# EAGLE board p8x-backplane-a (EAGLE 9.7.0)
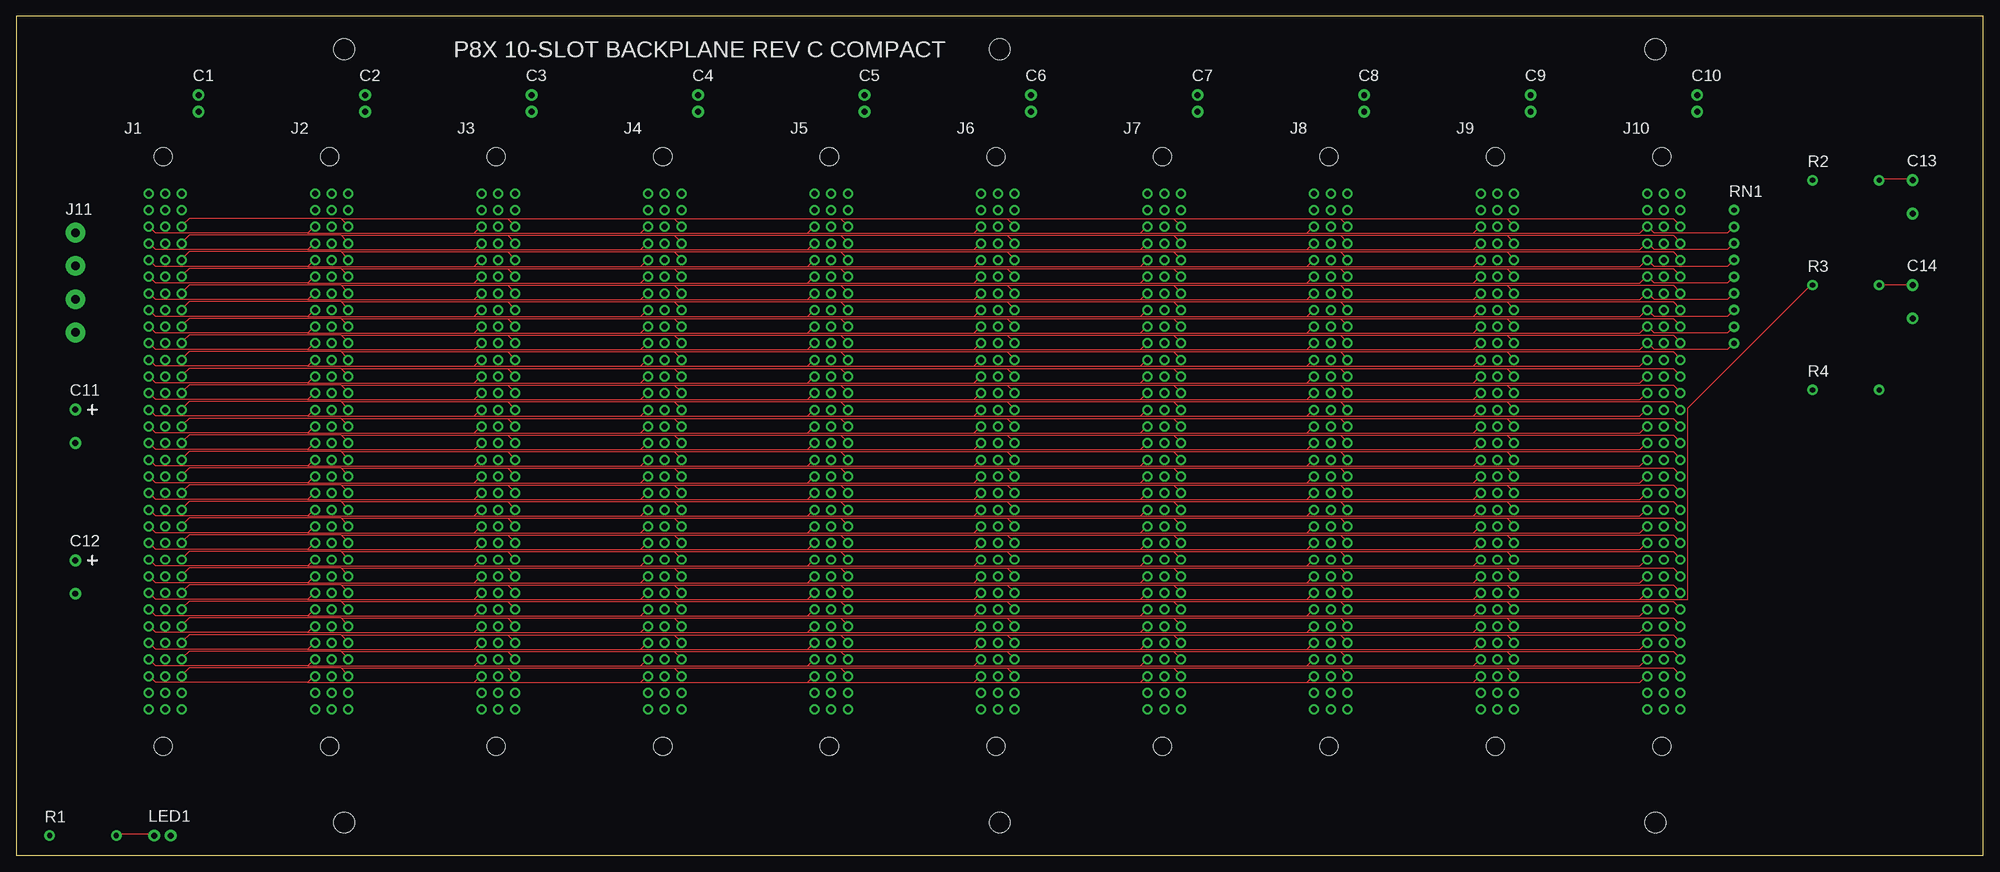
[diagram p5: board, top side]
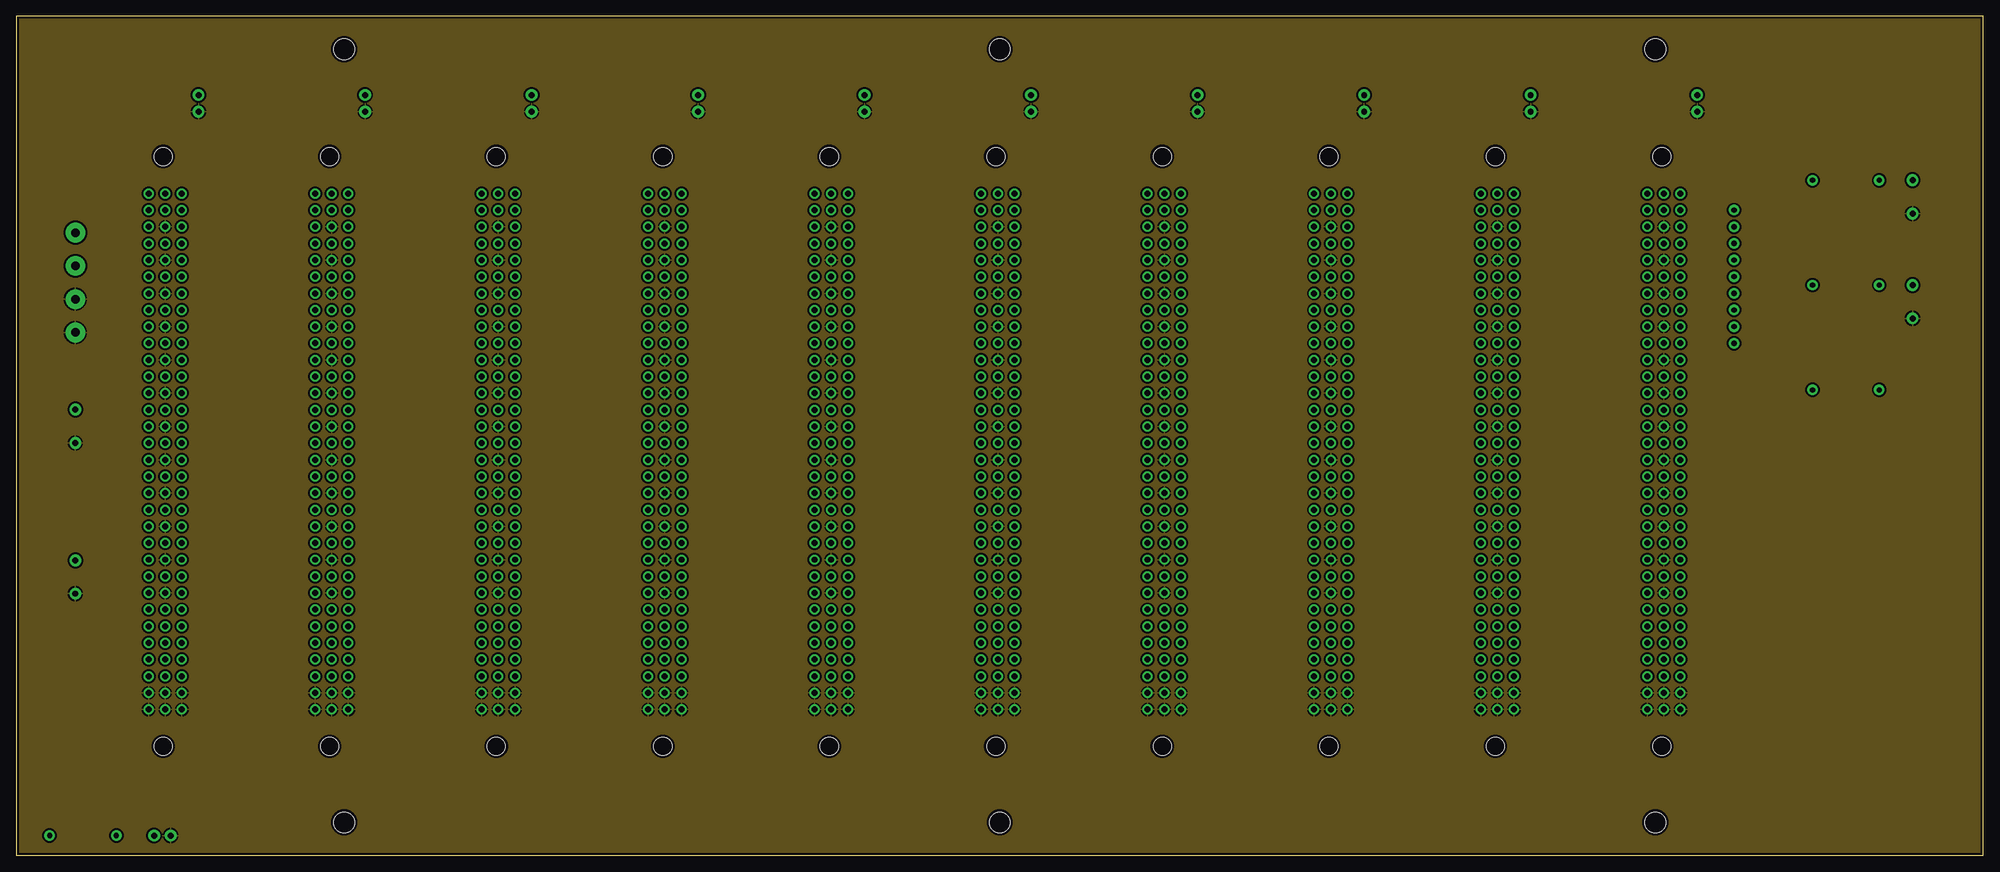
[diagram p6: board, inner layer Route2]
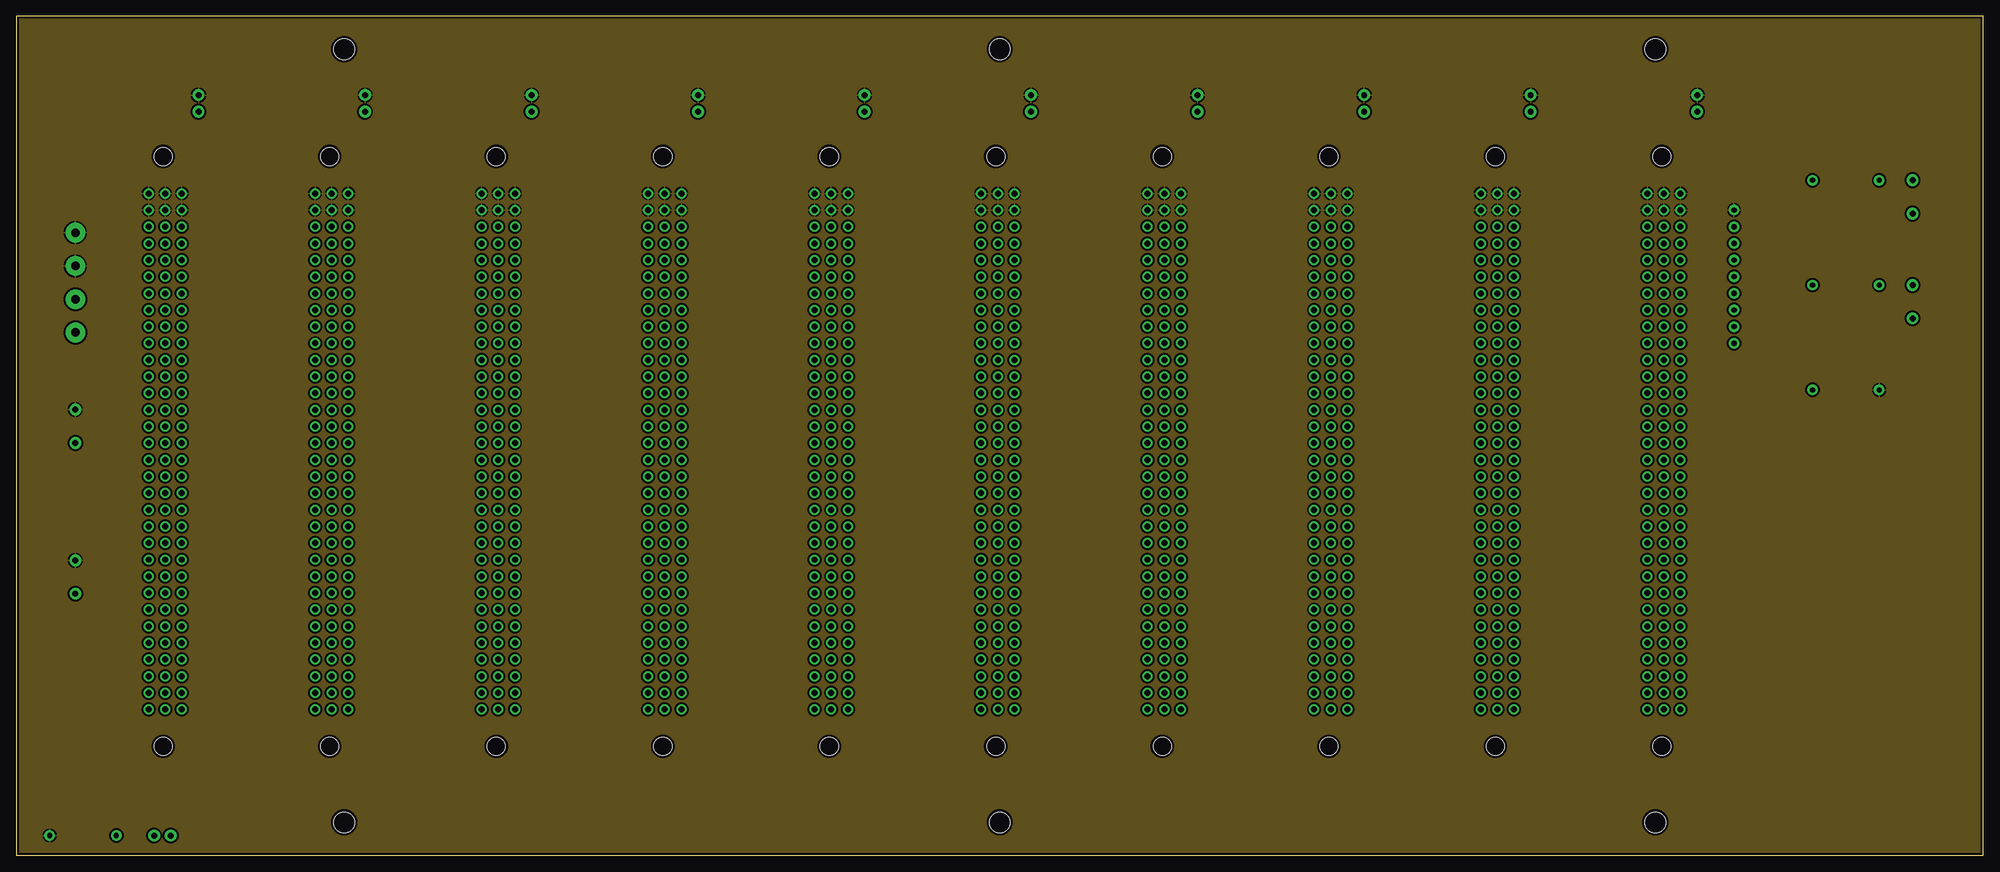
[diagram p7: board, inner layer Route15]
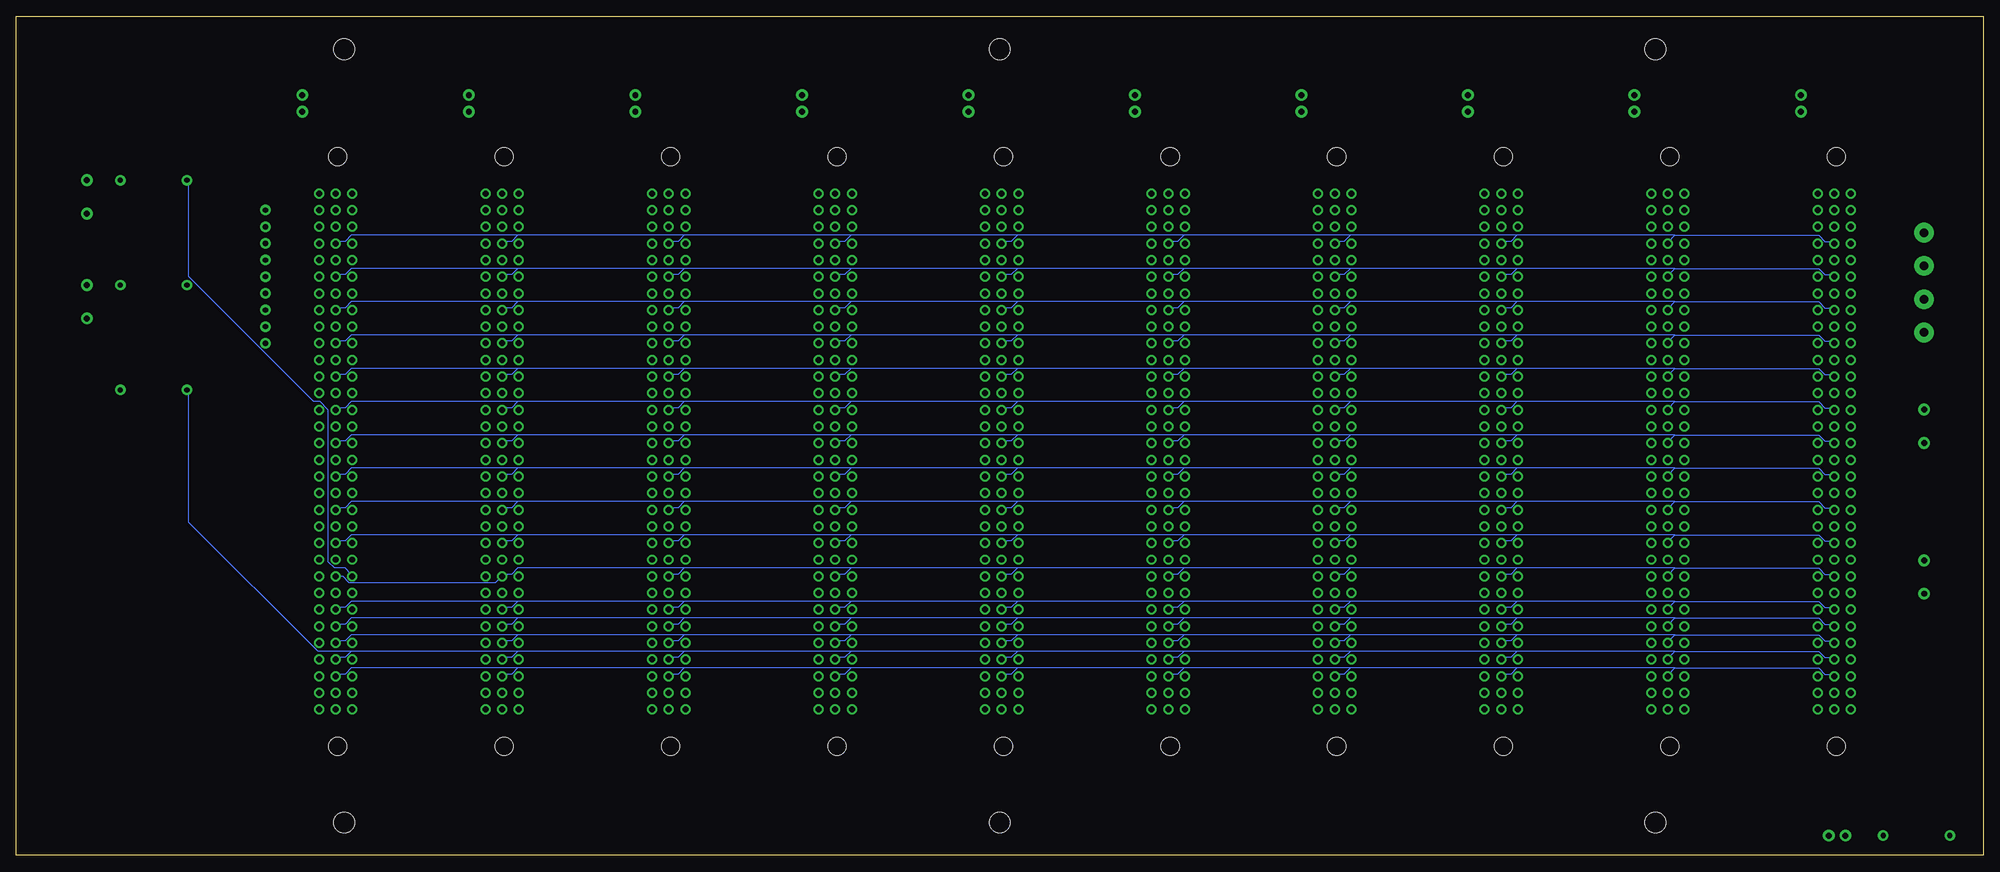
[diagram p8: board, bottom side, seen from below]

Size 300 x 128 mm. Coordinates in mm from the lower left corner, seen from the top.
Outline: 0,0 300,0 300,128 0,128 0,0
Copper layers (1*2*15*16): Top 0.035559375mm / dielectric 0.17018125mm / Route2 0.01778125mm / dielectric 47mil / Route15 0.01778125mm / dielectric 0.17018125mm / Bottom 0.035559375mm
Design rules "oshpark-4layer.dru": minimum track width 5mil, minimum drill 10mil, track to track 5mil, track to pad 5mil, pad to pad 5mil, via to via 5mil, smd to smd 5mil, copper to edge 15mil, drill to drill 6mil, minimum pad ring 4mil, minimum via ring 4mil, stop-mask expansion 1.5mil, vias tented up to drill 0mil, thermal gap 10mil
Holes 3.2 mm at 50,5 150,5 250,5 50,123 150,123 250,123

## Footprints (pad centres in the part's own frame; a part is rotated, then mirrored left to right if it is on the bottom)
C_DISC1 = drill 0.9 pad 1.8: 1 0,0; 2 0,-2.54
CP_RADIAL = drill 0.9 pad 1.8: 1 0,0; 2 0,-5.08
C_DISC = drill 0.9 pad 1.8: 1 0,0; 2 0,-5.08
FABC96S = drill 0.914 pad 1.524: A1 -2.54,39.37; A2 -2.54,36.83; A3 -2.54,34.29; A4 -2.54,31.75; A5 -2.54,29.21; A6 -2.54,26.67; A7 -2.54,24.13; A8 -2.54,21.59; A9 -2.54,19.05; A10 -2.54,16.51; A11 -2.54,13.97; A12 -2.54,11.43; A13 -2.54,8.89; A14 -2.54,6.35; A15 -2.54,3.81; A16 -2.54,1.27; A17 -2.54,-1.27; A18 -2.54,-3.81; A19 -2.54,-6.35; A20 -2.54,-8.89; A21 -2.54,-11.43; A22 -2.54,-13.97; A23 -2.54,-16.51; A24 -2.54,-19.05; A25 -2.54,-21.59; A26 -2.54,-24.13; A27 -2.54,-26.67; A28 -2.54,-29.21; A29 -2.54,-31.75; A30 -2.54,-34.29; A31 -2.54,-36.83; A32 -2.54,-39.37; B1 0,39.37; B2 0,36.83; B3 0,34.29; B4 0,31.75; B5 0,29.21; B6 0,26.67; B7 0,24.13; B8 0,21.59; B9 0,19.05; B10 0,16.51; B11 0,13.97; B12 0,11.43; B13 0,8.89; B14 0,6.35; B15 0,3.81; B16 0,1.27; B17 0,-1.27; B18 0,-3.81; B19 0,-6.35; B20 0,-8.89; B21 0,-11.43; B22 0,-13.97; B23 0,-16.51; B24 0,-19.05; B25 0,-21.59; B26 0,-24.13; B27 0,-26.67; B28 0,-29.21; B29 0,-31.75; B30 0,-34.29; B31 0,-36.83; B32 0,-39.37; C1 2.54,39.37; C2 2.54,36.83; C3 2.54,34.29; C4 2.54,31.75; C5 2.54,29.21; C6 2.54,26.67; C7 2.54,24.13; C8 2.54,21.59; C9 2.54,19.05; C10 2.54,16.51; C11 2.54,13.97; C12 2.54,11.43; C13 2.54,8.89; C14 2.54,6.35; C15 2.54,3.81; C16 2.54,1.27; C17 2.54,-1.27; C18 2.54,-3.81; C19 2.54,-6.35; C20 2.54,-8.89; C21 2.54,-11.43; C22 2.54,-13.97; C23 2.54,-16.51; C24 2.54,-19.05; C25 2.54,-21.59; C26 2.54,-24.13; C27 2.54,-26.67; C28 2.54,-29.21; C29 2.54,-31.75; C30 2.54,-34.29; C31 2.54,-36.83; C32 2.54,-39.37 | hole 2.794: -0.3,45; -0.3,-45
TB4 = drill 1.3 pad 3: 1 0,0; 2 0,-5.08; 3 0,-10.16; 4 0,-15.24
LED5 = drill 0.9 pad 1.8: 1 2.54,0; 2 0,0
R_AXIAL = drill 0.8 pad 1.6: 1 0,0; 2 10.16,0
SIP9 = drill 0.8 pad 1.6: 1 0,0; 2 0,-2.54; 3 0,-5.08; 4 0,-7.62; 5 0,-10.16; 6 0,-12.7; 7 0,-15.24; 8 0,-17.78; 9 0,-20.32

## Placement (x,y rotation side)
C1  100nF  [C_DISC1]  27.78,116 0 top
C2  100nF  [C_DISC1]  53.18,116 0 top
C3  100nF  [C_DISC1]  78.58,116 0 top
C4  100nF  [C_DISC1]  103.98,116 0 top
C5  100nF  [C_DISC1]  129.38,116 0 top
C6  100nF  [C_DISC1]  154.78,116 0 top
C7  100nF  [C_DISC1]  180.18,116 0 top
C8  100nF  [C_DISC1]  205.58,116 0 top
C9  100nF  [C_DISC1]  230.98,116 0 top
C10  100nF  [C_DISC1]  256.38,116 0 top
C11  470uF  [CP_RADIAL]  9,68 0 top
C12  470uF  [CP_RADIAL]  9,45 0 top
C13  150pF  [C_DISC]  289.24,103 0 top
C14  150pF  [C_DISC]  289.24,87 0 top
J1  SLOT1  [FABC96S]  22.7,61.61 0 top
J2  SLOT2  [FABC96S]  48.1,61.61 0 top
J3  SLOT3  [FABC96S]  73.5,61.61 0 top
J4  SLOT4  [FABC96S]  98.9,61.61 0 top
J5  SLOT5  [FABC96S]  124.3,61.61 0 top
J6  SLOT6  [FABC96S]  149.7,61.61 0 top
J7  SLOT7  [FABC96S]  175.1,61.61 0 top
J8  SLOT8  [FABC96S]  200.5,61.61 0 top
J9  SLOT9  [FABC96S]  225.9,61.61 0 top
J10  SLOT10  [FABC96S]  251.3,61.61 0 top
J11  PWR-5V  [TB4]  9,95 0 top
LED1  PWR  [LED5]  21,3 0 top
R1  1K  [R_AXIAL]  5.08,3 0 top
R2  100R  [R_AXIAL]  274,103 0 top
R3  100R  [R_AXIAL]  274,87 0 top
R4  10K  [R_AXIAL]  274,71 0 top
RN1  8X10K  [SIP9]  262,98.44 0 top

## Tracks (layer width: path | path; a pad name or v marks a point on that pad's centre or on a via)
-RES
  Top 0.127: 44.45,74.61 21.27,74.61 20.32,75.56 J1.A11 | 44.45,74.61 45.4,75.56 J2.A11 | 69.85,74.61 70.8,75.56 J3.A11 | 44.45,74.61 69.85,74.61 | 95.25,74.61 96.2,75.56 J4.A11 | 69.85,74.61 95.25,74.61 | 120.65,74.61 121.6,75.56 J5.A11 | 95.25,74.61 120.65,74.61 | 146.05,74.61 147,75.56 J6.A11 | 120.65,74.61 146.05,74.61 | 171.45,74.61 172.4,75.56 J7.A11 | 146.05,74.61 171.45,74.61 | 196.85,74.61 197.8,75.56 J8.A11 | 171.45,74.61 196.85,74.61 | 222.25,74.61 223.2,75.56 J9.A11 | 196.85,74.61 222.25,74.61 | 222.25,74.61 247.65,74.61 248.6,75.56 J10.A11
A0
  Top 0.127: 49.53,97.16 26.35,97.16 25.4,96.2 J1.C3 | 49.53,97.16 50.48,96.2 J2.C3 | 74.93,97.16 75.88,96.2 J3.C3 | 49.53,97.16 74.93,97.16 | 100.33,97.16 101.28,96.2 J4.C3 | 74.93,97.16 100.33,97.16 | 125.73,97.16 126.68,96.2 J5.C3 | 100.33,97.16 125.73,97.16 | 151.13,97.16 152.08,96.2 J6.C3 | 125.73,97.16 151.13,97.16 | 176.53,97.16 177.48,96.2 J7.C3 | 151.13,97.16 176.53,97.16 | 201.93,97.16 202.88,96.2 J8.C3 | 176.53,97.16 201.93,97.16 | 227.33,97.16 228.28,96.2 J9.C3 | 201.93,97.16 227.33,97.16 | 227.33,97.16 252.73,97.16 253.68,96.2 J10.C3
A1
  Top 0.127: 49.53,94.61 26.35,94.61 25.4,93.66 J1.C4 | 49.53,94.61 50.48,93.66 J2.C4 | 74.93,94.61 75.88,93.66 J3.C4 | 49.53,94.61 74.93,94.61 | 100.33,94.61 101.28,93.66 J4.C4 | 74.93,94.61 100.33,94.61 | 125.73,94.61 126.68,93.66 J5.C4 | 100.33,94.61 125.73,94.61 | 151.13,94.61 152.08,93.66 J6.C4 | 125.73,94.61 151.13,94.61 | 176.53,94.61 177.48,93.66 J7.C4 | 151.13,94.61 176.53,94.61 | 201.93,94.61 202.88,93.66 J8.C4 | 176.53,94.61 201.93,94.61 | 227.33,94.61 228.28,93.66 J9.C4 | 201.93,94.61 227.33,94.61 | 227.33,94.61 252.73,94.61 253.68,93.66 J10.C4
A2
  Top 0.127: 49.53,92.08 26.35,92.08 25.4,91.12 J1.C5 | 49.53,92.08 50.48,91.12 J2.C5 | 74.93,92.08 75.88,91.12 J3.C5 | 49.53,92.08 74.93,92.08 | 100.33,92.08 101.28,91.12 J4.C5 | 74.93,92.08 100.33,92.08 | 125.73,92.08 126.68,91.12 J5.C5 | 100.33,92.08 125.73,92.08 | 151.13,92.08 152.08,91.12 J6.C5 | 125.73,92.08 151.13,92.08 | 176.53,92.08 177.48,91.12 J7.C5 | 151.13,92.08 176.53,92.08 | 201.93,92.08 202.88,91.12 J8.C5 | 176.53,92.08 201.93,92.08 | 227.33,92.08 228.28,91.12 J9.C5 | 201.93,92.08 227.33,92.08 | 227.33,92.08 252.73,92.08 253.68,91.12 J10.C5
A3
  Top 0.127: 49.53,89.53 26.35,89.53 25.4,88.58 J1.C6 | 49.53,89.53 50.48,88.58 J2.C6 | 74.93,89.53 75.88,88.58 J3.C6 | 49.53,89.53 74.93,89.53 | 100.33,89.53 101.28,88.58 J4.C6 | 74.93,89.53 100.33,89.53 | 125.73,89.53 126.68,88.58 J5.C6 | 100.33,89.53 125.73,89.53 | 151.13,89.53 152.08,88.58 J6.C6 | 125.73,89.53 151.13,89.53 | 176.53,89.53 177.48,88.58 J7.C6 | 151.13,89.53 176.53,89.53 | 201.93,89.53 202.88,88.58 J8.C6 | 176.53,89.53 201.93,89.53 | 227.33,89.53 228.28,88.58 J9.C6 | 201.93,89.53 227.33,89.53 | 227.33,89.53 252.73,89.53 253.68,88.58 J10.C6
A4
  Top 0.127: 49.53,87 26.35,87 25.4,86.04 J1.C7 | 49.53,87 50.48,86.04 J2.C7 | 74.93,87 75.88,86.04 J3.C7 | 49.53,87 74.93,87 | 100.33,87 101.28,86.04 J4.C7 | 74.93,87 100.33,87 | 125.73,87 126.68,86.04 J5.C7 | 100.33,87 125.73,87 | 151.13,87 152.08,86.04 J6.C7 | 125.73,87 151.13,87 | 176.53,87 177.48,86.04 J7.C7 | 151.13,87 176.53,87 | 201.93,87 202.88,86.04 J8.C7 | 176.53,87 201.93,87 | 227.33,87 228.28,86.04 J9.C7 | 201.93,87 227.33,87 | 227.33,87 252.73,87 253.68,86.04 J10.C7
A5
  Top 0.127: 49.53,84.45 26.35,84.45 25.4,83.5 J1.C8 | 49.53,84.45 50.48,83.5 J2.C8 | 74.93,84.45 75.88,83.5 J3.C8 | 49.53,84.45 74.93,84.45 | 100.33,84.45 101.28,83.5 J4.C8 | 74.93,84.45 100.33,84.45 | 125.73,84.45 126.68,83.5 J5.C8 | 100.33,84.45 125.73,84.45 | 151.13,84.45 152.08,83.5 J6.C8 | 125.73,84.45 151.13,84.45 | 176.53,84.45 177.48,83.5 J7.C8 | 151.13,84.45 176.53,84.45 | 201.93,84.45 202.88,83.5 J8.C8 | 176.53,84.45 201.93,84.45 | 227.33,84.45 228.28,83.5 J9.C8 | 201.93,84.45 227.33,84.45 | 227.33,84.45 252.73,84.45 253.68,83.5 J10.C8
A6
  Top 0.127: 49.53,81.92 26.35,81.92 25.4,80.96 J1.C9 | 49.53,81.92 50.48,80.96 J2.C9 | 74.93,81.92 75.88,80.96 J3.C9 | 49.53,81.92 74.93,81.92 | 100.33,81.92 101.28,80.96 J4.C9 | 74.93,81.92 100.33,81.92 | 125.73,81.92 126.68,80.96 J5.C9 | 100.33,81.92 125.73,81.92 | 151.13,81.92 152.08,80.96 J6.C9 | 125.73,81.92 151.13,81.92 | 176.53,81.92 177.48,80.96 J7.C9 | 151.13,81.92 176.53,81.92 | 201.93,81.92 202.88,80.96 J8.C9 | 176.53,81.92 201.93,81.92 | 227.33,81.92 228.28,80.96 J9.C9 | 201.93,81.92 227.33,81.92 | 227.33,81.92 252.73,81.92 253.68,80.96 J10.C9
A7
  Top 0.127: 49.53,79.38 26.35,79.38 25.4,78.42 J1.C10 | 49.53,79.38 50.48,78.42 J2.C10 | 74.93,79.38 75.88,78.42 J3.C10 | 49.53,79.38 74.93,79.38 | 100.33,79.38 101.28,78.42 J4.C10 | 74.93,79.38 100.33,79.38 | 125.73,79.38 126.68,78.42 J5.C10 | 100.33,79.38 125.73,79.38 | 151.13,79.38 152.08,78.42 J6.C10 | 125.73,79.38 151.13,79.38 | 176.53,79.38 177.48,78.42 J7.C10 | 151.13,79.38 176.53,79.38 | 201.93,79.38 202.88,78.42 J8.C10 | 176.53,79.38 201.93,79.38 | 227.33,79.38 228.28,78.42 J9.C10 | 201.93,79.38 227.33,79.38 | 227.33,79.38 252.73,79.38 253.68,78.42 J10.C10
A8
  Top 0.127: 49.53,76.83 26.35,76.83 25.4,75.88 J1.C11 | 49.53,76.83 50.48,75.88 J2.C11 | 74.93,76.83 75.88,75.88 J3.C11 | 49.53,76.83 74.93,76.83 | 100.33,76.83 101.28,75.88 J4.C11 | 74.93,76.83 100.33,76.83 | 125.73,76.83 126.68,75.88 J5.C11 | 100.33,76.83 125.73,76.83 | 151.13,76.83 152.08,75.88 J6.C11 | 125.73,76.83 151.13,76.83 | 176.53,76.83 177.48,75.88 J7.C11 | 151.13,76.83 176.53,76.83 | 201.93,76.83 202.88,75.88 J8.C11 | 176.53,76.83 201.93,76.83 | 227.33,76.83 228.28,75.88 J9.C11 | 201.93,76.83 227.33,76.83 | 227.33,76.83 252.73,76.83 253.68,75.88 J10.C11
A9
  Top 0.127: 49.53,74.3 26.35,74.3 25.4,73.34 J1.C12 | 49.53,74.3 50.48,73.34 J2.C12 | 74.93,74.3 75.88,73.34 J3.C12 | 49.53,74.3 74.93,74.3 | 100.33,74.3 101.28,73.34 J4.C12 | 74.93,74.3 100.33,74.3 | 125.73,74.3 126.68,73.34 J5.C12 | 100.33,74.3 125.73,74.3 | 151.13,74.3 152.08,73.34 J6.C12 | 125.73,74.3 151.13,74.3 | 176.53,74.3 177.48,73.34 J7.C12 | 151.13,74.3 176.53,74.3 | 201.93,74.3 202.88,73.34 J8.C12 | 176.53,74.3 201.93,74.3 | 227.33,74.3 228.28,73.34 J9.C12 | 201.93,74.3 227.33,74.3 | 227.33,74.3 252.73,74.3 253.68,73.34 J10.C12
A10
  Top 0.127: 49.53,71.75 26.35,71.75 25.4,70.8 J1.C13 | 49.53,71.75 50.48,70.8 J2.C13 | 74.93,71.75 75.88,70.8 J3.C13 | 49.53,71.75 74.93,71.75 | 100.33,71.75 101.28,70.8 J4.C13 | 74.93,71.75 100.33,71.75 | 125.73,71.75 126.68,70.8 J5.C13 | 100.33,71.75 125.73,71.75 | 151.13,71.75 152.08,70.8 J6.C13 | 125.73,71.75 151.13,71.75 | 176.53,71.75 177.48,70.8 J7.C13 | 151.13,71.75 176.53,71.75 | 201.93,71.75 202.88,70.8 J8.C13 | 176.53,71.75 201.93,71.75 | 227.33,71.75 228.28,70.8 J9.C13 | 201.93,71.75 227.33,71.75 | 227.33,71.75 252.73,71.75 253.68,70.8 J10.C13
A11
  Top 0.127: 49.53,69.22 26.35,69.22 25.4,68.26 J1.C14 | 49.53,69.22 50.48,68.26 J2.C14 | 74.93,69.22 75.88,68.26 J3.C14 | 49.53,69.22 74.93,69.22 | 100.33,69.22 101.28,68.26 J4.C14 | 74.93,69.22 100.33,69.22 | 125.73,69.22 126.68,68.26 J5.C14 | 100.33,69.22 125.73,69.22 | 151.13,69.22 152.08,68.26 J6.C14 | 125.73,69.22 151.13,69.22 | 176.53,69.22 177.48,68.26 J7.C14 | 151.13,69.22 176.53,69.22 | 201.93,69.22 202.88,68.26 J8.C14 | 176.53,69.22 201.93,69.22 | 227.33,69.22 228.28,68.26 J9.C14 | 201.93,69.22 227.33,69.22 | 227.33,69.22 252.73,69.22 253.68,68.26 J10.C14
A12
  Top 0.127: 49.53,66.67 26.35,66.67 25.4,65.72 J1.C15 | 49.53,66.67 50.48,65.72 J2.C15 | 74.93,66.67 75.88,65.72 J3.C15 | 49.53,66.67 74.93,66.67 | 100.33,66.67 101.28,65.72 J4.C15 | 74.93,66.67 100.33,66.67 | 125.73,66.67 126.68,65.72 J5.C15 | 100.33,66.67 125.73,66.67 | 151.13,66.67 152.08,65.72 J6.C15 | 125.73,66.67 151.13,66.67 | 176.53,66.67 177.48,65.72 J7.C15 | 151.13,66.67 176.53,66.67 | 201.93,66.67 202.88,65.72 J8.C15 | 176.53,66.67 201.93,66.67 | 227.33,66.67 228.28,65.72 J9.C15 | 201.93,66.67 227.33,66.67 | 227.33,66.67 252.73,66.67 253.68,65.72 J10.C15
A13
  Top 0.127: 49.53,64.14 26.35,64.14 25.4,63.18 J1.C16 | 49.53,64.14 50.48,63.18 J2.C16 | 74.93,64.14 75.88,63.18 J3.C16 | 49.53,64.14 74.93,64.14 | 100.33,64.14 101.28,63.18 J4.C16 | 74.93,64.14 100.33,64.14 | 125.73,64.14 126.68,63.18 J5.C16 | 100.33,64.14 125.73,64.14 | 151.13,64.14 152.08,63.18 J6.C16 | 125.73,64.14 151.13,64.14 | 176.53,64.14 177.48,63.18 J7.C16 | 151.13,64.14 176.53,64.14 | 201.93,64.14 202.88,63.18 J8.C16 | 176.53,64.14 201.93,64.14 | 227.33,64.14 228.28,63.18 J9.C16 | 201.93,64.14 227.33,64.14 | 227.33,64.14 252.73,64.14 253.68,63.18 J10.C16
A14
  Top 0.127: 49.53,61.59 26.35,61.59 25.4,60.64 J1.C17 | 49.53,61.59 50.48,60.64 J2.C17 | 74.93,61.59 75.88,60.64 J3.C17 | 49.53,61.59 74.93,61.59 | 100.33,61.59 101.28,60.64 J4.C17 | 74.93,61.59 100.33,61.59 | 125.73,61.59 126.68,60.64 J5.C17 | 100.33,61.59 125.73,61.59 | 151.13,61.59 152.08,60.64 J6.C17 | 125.73,61.59 151.13,61.59 | 176.53,61.59 177.48,60.64 J7.C17 | 151.13,61.59 176.53,61.59 | 201.93,61.59 202.88,60.64 J8.C17 | 176.53,61.59 201.93,61.59 | 227.33,61.59 228.28,60.64 J9.C17 | 201.93,61.59 227.33,61.59 | 227.33,61.59 252.73,61.59 253.68,60.64 J10.C17
A15
  Top 0.127: 49.53,59.05 26.35,59.05 25.4,58.1 J1.C18 | 49.53,59.05 50.48,58.1 J2.C18 | 74.93,59.05 75.88,58.1 J3.C18 | 49.53,59.05 74.93,59.05 | 100.33,59.05 101.28,58.1 J4.C18 | 74.93,59.05 100.33,59.05 | 125.73,59.05 126.68,58.1 J5.C18 | 100.33,59.05 125.73,59.05 | 151.13,59.05 152.08,58.1 J6.C18 | 125.73,59.05 151.13,59.05 | 176.53,59.05 177.48,58.1 J7.C18 | 151.13,59.05 176.53,59.05 | 201.93,59.05 202.88,58.1 J8.C18 | 176.53,59.05 201.93,59.05 | 227.33,59.05 228.28,58.1 J9.C18 | 201.93,59.05 227.33,59.05 | 227.33,59.05 252.73,59.05 253.68,58.1 J10.C18
ALUM
  Top 0.127: 49.53,46.35 26.35,46.35 25.4,45.4 J1.C23 | 49.53,46.35 50.48,45.4 J2.C23 | 74.93,46.35 75.88,45.4 J3.C23 | 49.53,46.35 74.93,46.35 | 100.33,46.35 101.28,45.4 J4.C23 | 74.93,46.35 100.33,46.35 | 125.73,46.35 126.68,45.4 J5.C23 | 100.33,46.35 125.73,46.35 | 151.13,46.35 152.08,45.4 J6.C23 | 125.73,46.35 151.13,46.35 | 176.53,46.35 177.48,45.4 J7.C23 | 151.13,46.35 176.53,46.35 | 201.93,46.35 202.88,45.4 J8.C23 | 176.53,46.35 201.93,46.35 | 227.33,46.35 228.28,45.4 J9.C23 | 201.93,46.35 227.33,46.35 | 227.33,46.35 252.73,46.35 253.68,45.4 J10.C23
ALUS0
  Top 0.127: 49.53,56.52 26.35,56.52 25.4,55.56 J1.C19 | 49.53,56.52 50.48,55.56 J2.C19 | 74.93,56.52 75.88,55.56 J3.C19 | 49.53,56.52 74.93,56.52 | 100.33,56.52 101.28,55.56 J4.C19 | 74.93,56.52 100.33,56.52 | 125.73,56.52 126.68,55.56 J5.C19 | 100.33,56.52 125.73,56.52 | 151.13,56.52 152.08,55.56 J6.C19 | 125.73,56.52 151.13,56.52 | 176.53,56.52 177.48,55.56 J7.C19 | 151.13,56.52 176.53,56.52 | 201.93,56.52 202.88,55.56 J8.C19 | 176.53,56.52 201.93,56.52 | 227.33,56.52 228.28,55.56 J9.C19 | 201.93,56.52 227.33,56.52 | 227.33,56.52 252.73,56.52 253.68,55.56 J10.C19
ALUS1
  Top 0.127: 49.53,53.98 26.35,53.98 25.4,53.02 J1.C20 | 49.53,53.98 50.48,53.02 J2.C20 | 74.93,53.98 75.88,53.02 J3.C20 | 49.53,53.98 74.93,53.98 | 100.33,53.98 101.28,53.02 J4.C20 | 74.93,53.98 100.33,53.98 | 125.73,53.98 126.68,53.02 J5.C20 | 100.33,53.98 125.73,53.98 | 151.13,53.98 152.08,53.02 J6.C20 | 125.73,53.98 151.13,53.98 | 176.53,53.98 177.48,53.02 J7.C20 | 151.13,53.98 176.53,53.98 | 201.93,53.98 202.88,53.02 J8.C20 | 176.53,53.98 201.93,53.98 | 227.33,53.98 228.28,53.02 J9.C20 | 201.93,53.98 227.33,53.98 | 227.33,53.98 252.73,53.98 253.68,53.02 J10.C20
ALUS2
  Top 0.127: 49.53,51.44 26.35,51.44 25.4,50.48 J1.C21 | 49.53,51.44 50.48,50.48 J2.C21 | 74.93,51.44 75.88,50.48 J3.C21 | 49.53,51.44 74.93,51.44 | 100.33,51.44 101.28,50.48 J4.C21 | 74.93,51.44 100.33,51.44 | 125.73,51.44 126.68,50.48 J5.C21 | 100.33,51.44 125.73,51.44 | 151.13,51.44 152.08,50.48 J6.C21 | 125.73,51.44 151.13,51.44 | 176.53,51.44 177.48,50.48 J7.C21 | 151.13,51.44 176.53,51.44 | 201.93,51.44 202.88,50.48 J8.C21 | 176.53,51.44 201.93,51.44 | 227.33,51.44 228.28,50.48 J9.C21 | 201.93,51.44 227.33,51.44 | 227.33,51.44 252.73,51.44 253.68,50.48 J10.C21
ALUS3
  Top 0.127: 49.53,48.9 26.35,48.9 25.4,47.94 J1.C22 | 49.53,48.9 50.48,47.94 J2.C22 | 74.93,48.9 75.88,47.94 J3.C22 | 49.53,48.9 74.93,48.9 | 100.33,48.9 101.28,47.94 J4.C22 | 74.93,48.9 100.33,48.9 | 125.73,48.9 126.68,47.94 J5.C22 | 100.33,48.9 125.73,48.9 | 151.13,48.9 152.08,47.94 J6.C22 | 125.73,48.9 151.13,48.9 | 176.53,48.9 177.48,47.94 J7.C22 | 151.13,48.9 176.53,48.9 | 201.93,48.9 202.88,47.94 J8.C22 | 176.53,48.9 201.93,48.9 | 227.33,48.9 228.28,47.94 J9.C22 | 201.93,48.9 227.33,48.9 | 227.33,48.9 252.73,48.9 253.68,47.94 J10.C22
BSEL
  Bottom 0.127: 46.99,33.66 25.08,33.66 24.13,32.7 22.86,32.7 J1.B28 | 46.99,33.66 47.94,32.7 J2.B28 | 71.12,33.66 72.07,32.7 73.34,32.7 J3.B28 | 46.99,33.66 71.12,33.66 | 96.52,33.66 97.47,32.7 98.74,32.7 J4.B28 | 71.12,33.66 96.52,33.66 | 121.92,33.66 122.87,32.7 124.14,32.7 J5.B28 | 96.52,33.66 121.92,33.66 | 147.32,33.66 148.27,32.7 149.54,32.7 J6.B28 | 121.92,33.66 147.32,33.66 | 172.72,33.66 173.67,32.7 174.94,32.7 J7.B28 | 147.32,33.66 172.72,33.66 | 198.12,33.66 199.07,32.7 200.34,32.7 J8.B28 | 172.72,33.66 198.12,33.66 | 223.52,33.66 224.47,32.7 225.74,32.7 J9.B28 | 198.12,33.66 223.52,33.66 | 223.52,33.66 248.92,33.66 249.87,32.7 251.14,32.7 J10.B28
CIN
  Top 0.127: 49.53,43.81 26.35,43.81 25.4,42.86 J1.C24 | 49.53,43.81 50.48,42.86 J2.C24 | 74.93,43.81 75.88,42.86 J3.C24 | 49.53,43.81 74.93,43.81 | 100.33,43.81 101.28,42.86 J4.C24 | 74.93,43.81 100.33,43.81 | 125.73,43.81 126.68,42.86 J5.C24 | 100.33,43.81 125.73,43.81 | 151.13,43.81 152.08,42.86 J6.C24 | 125.73,43.81 151.13,43.81 | 176.53,43.81 177.48,42.86 J7.C24 | 151.13,43.81 176.53,43.81 | 201.93,43.81 202.88,42.86 J8.C24 | 176.53,43.81 201.93,43.81 | 227.33,43.81 228.28,42.86 J9.C24 | 201.93,43.81 227.33,43.81 | 227.33,43.81 252.73,43.81 253.68,42.86 J10.C24
CLK
  Top 0.127: 44.45,41.59 21.27,41.59 20.32,42.55 J1.A24 | 44.45,41.59 45.4,42.55 J2.A24 | 69.85,41.59 70.8,42.55 J3.A24 | 44.45,41.59 69.85,41.59 | 95.25,41.59 96.2,42.55 J4.A24 | 69.85,41.59 95.25,41.59 | 120.65,41.59 121.6,42.55 J5.A24 | 95.25,41.59 120.65,41.59 | 146.05,41.59 147,42.55 J6.A24 | 120.65,41.59 146.05,41.59 | 171.45,41.59 172.4,42.55 J7.A24 | 146.05,41.59 171.45,41.59 | 196.85,41.59 197.8,42.55 J8.A24 | 171.45,41.59 196.85,41.59 | 222.25,41.59 223.2,42.55 J9.A24 | 196.85,41.59 222.25,41.59 | 222.25,41.59 247.65,41.59 248.6,42.55 J10.A24
  Bottom 0.127: R2.1 273.69,102.87 273.69,88.27 254.63,69.22 253.68,69.22 252.41,67.94 252.41,44.77 251.46,43.81 249.87,43.81 248.92,42.86 J10.A24
CLK_T
  Top 0.127: R2.2 284.16,103.19 288.93,103.19 C13.1
CLKB
  Top 0.127: 44.45,39.05 21.27,39.05 20.32,40.01 J1.A25 | 44.45,39.05 45.4,40.01 J2.A25 | 69.85,39.05 70.8,40.01 J3.A25 | 44.45,39.05 69.85,39.05 | 95.25,39.05 96.2,40.01 J4.A25 | 69.85,39.05 95.25,39.05 | 120.65,39.05 121.6,40.01 J5.A25 | 95.25,39.05 120.65,39.05 | 146.05,39.05 147,40.01 J6.A25 | 120.65,39.05 146.05,39.05 | 171.45,39.05 172.4,40.01 J7.A25 | 146.05,39.05 171.45,39.05 | 196.85,39.05 197.8,40.01 J8.A25 | 171.45,39.05 196.85,39.05 | 222.25,39.05 223.2,40.01 J9.A25 | 196.85,39.05 222.25,39.05 | 247.65,39.05 248.6,40.01 J10.A25 | 222.25,39.05 247.65,39.05 | 247.65,39.05 254.95,39.05 254.95,68.26 273.69,87 R3.1
CLKB_T
  Top 0.127: R3.2 288.93,87 C14.1
CLRC
  Bottom 0.127: 46.99,36.2 25.08,36.2 24.13,35.24 22.86,35.24 J1.B27 | 46.99,36.2 47.94,35.24 J2.B27 | 71.12,36.2 72.07,35.24 73.34,35.24 J3.B27 | 46.99,36.2 71.12,36.2 | 96.52,36.2 97.47,35.24 98.74,35.24 J4.B27 | 71.12,36.2 96.52,36.2 | 121.92,36.2 122.87,35.24 124.14,35.24 J5.B27 | 96.52,36.2 121.92,36.2 | 147.32,36.2 148.27,35.24 149.54,35.24 J6.B27 | 121.92,36.2 147.32,36.2 | 172.72,36.2 173.67,35.24 174.94,35.24 J7.B27 | 147.32,36.2 172.72,36.2 | 198.12,36.2 199.07,35.24 200.34,35.24 J8.B27 | 172.72,36.2 198.12,36.2 | 223.52,36.2 224.47,35.24 225.74,35.24 J9.B27 | 198.12,36.2 223.52,36.2 | 223.52,36.2 248.92,36.2 249.87,35.24 251.14,35.24 J10.B27
D0
  Top 0.127: RN1.2 261.94,95.89 260.99,94.93 249.87,94.93 248.92,95.89 J10.A3 248.6,95.89 247.65,94.93 222.25,94.93 | 44.45,94.93 21.27,94.93 20.32,95.89 J1.A3 | 44.45,94.93 45.4,95.89 J2.A3 | 69.85,94.93 70.8,95.89 J3.A3 | 44.45,94.93 69.85,94.93 | 95.25,94.93 96.2,95.89 J4.A3 | 69.85,94.93 95.25,94.93 | 120.65,94.93 121.6,95.89 J5.A3 | 95.25,94.93 120.65,94.93 | 146.05,94.93 147,95.89 J6.A3 | 120.65,94.93 146.05,94.93 | 171.45,94.93 172.4,95.89 J7.A3 | 146.05,94.93 171.45,94.93 | 196.85,94.93 197.8,95.89 J8.A3 | 171.45,94.93 196.85,94.93 | 222.25,94.93 223.2,95.89 J9.A3 | 196.85,94.93 222.25,94.93
D1
  Top 0.127: RN1.3 261.94,93.34 260.99,92.39 249.87,92.39 248.92,93.34 J10.A4 248.6,93.34 247.65,92.39 222.25,92.39 | 44.45,92.39 21.27,92.39 20.32,93.34 J1.A4 | 44.45,92.39 45.4,93.34 J2.A4 | 69.85,92.39 70.8,93.34 J3.A4 | 44.45,92.39 69.85,92.39 | 95.25,92.39 96.2,93.34 J4.A4 | 69.85,92.39 95.25,92.39 | 120.65,92.39 121.6,93.34 J5.A4 | 95.25,92.39 120.65,92.39 | 146.05,92.39 147,93.34 J6.A4 | 120.65,92.39 146.05,92.39 | 171.45,92.39 172.4,93.34 J7.A4 | 146.05,92.39 171.45,92.39 | 196.85,92.39 197.8,93.34 J8.A4 | 171.45,92.39 196.85,92.39 | 222.25,92.39 223.2,93.34 J9.A4 | 196.85,92.39 222.25,92.39
D2
  Top 0.127: RN1.4 261.94,90.81 260.99,89.85 249.87,89.85 248.92,90.81 J10.A5 248.6,90.81 247.65,89.85 222.25,89.85 | 44.45,89.85 21.27,89.85 20.32,90.81 J1.A5 | 44.45,89.85 45.4,90.81 J2.A5 | 69.85,89.85 70.8,90.81 J3.A5 | 44.45,89.85 69.85,89.85 | 95.25,89.85 96.2,90.81 J4.A5 | 69.85,89.85 95.25,89.85 | 120.65,89.85 121.6,90.81 J5.A5 | 95.25,89.85 120.65,89.85 | 146.05,89.85 147,90.81 J6.A5 | 120.65,89.85 146.05,89.85 | 171.45,89.85 172.4,90.81 J7.A5 | 146.05,89.85 171.45,89.85 | 196.85,89.85 197.8,90.81 J8.A5 | 171.45,89.85 196.85,89.85 | 222.25,89.85 223.2,90.81 J9.A5 | 196.85,89.85 222.25,89.85
D3
  Top 0.127: RN1.5 261.94,88.27 260.99,87.31 249.87,87.31 248.92,88.27 J10.A6 248.6,88.27 247.65,87.31 222.25,87.31 | 44.45,87.31 21.27,87.31 20.32,88.27 J1.A6 | 44.45,87.31 45.4,88.27 J2.A6 | 69.85,87.31 70.8,88.27 J3.A6 | 44.45,87.31 69.85,87.31 | 95.25,87.31 96.2,88.27 J4.A6 | 69.85,87.31 95.25,87.31 | 120.65,87.31 121.6,88.27 J5.A6 | 95.25,87.31 120.65,87.31 | 146.05,87.31 147,88.27 J6.A6 | 120.65,87.31 146.05,87.31 | 171.45,87.31 172.4,88.27 J7.A6 | 146.05,87.31 171.45,87.31 | 196.85,87.31 197.8,88.27 J8.A6 | 171.45,87.31 196.85,87.31 | 222.25,87.31 223.2,88.27 J9.A6 | 196.85,87.31 222.25,87.31
D4
  Top 0.127: RN1.6 261.94,85.72 260.99,84.77 249.87,84.77 248.92,85.72 J10.A7 248.6,85.72 247.65,84.77 222.25,84.77 | 44.45,84.77 21.27,84.77 20.32,85.72 J1.A7 | 44.45,84.77 45.4,85.72 J2.A7 | 69.85,84.77 70.8,85.72 J3.A7 | 44.45,84.77 69.85,84.77 | 95.25,84.77 96.2,85.72 J4.A7 | 69.85,84.77 95.25,84.77 | 120.65,84.77 121.6,85.72 J5.A7 | 95.25,84.77 120.65,84.77 | 146.05,84.77 147,85.72 J6.A7 | 120.65,84.77 146.05,84.77 | 171.45,84.77 172.4,85.72 J7.A7 | 146.05,84.77 171.45,84.77 | 196.85,84.77 197.8,85.72 J8.A7 | 171.45,84.77 196.85,84.77 | 222.25,84.77 223.2,85.72 J9.A7 | 196.85,84.77 222.25,84.77
D5
  Top 0.127: RN1.7 261.94,83.19 260.99,82.23 249.87,82.23 248.92,83.19 J10.A8 248.6,83.19 247.65,82.23 222.25,82.23 | 44.45,82.23 21.27,82.23 20.32,83.19 J1.A8 | 44.45,82.23 45.4,83.19 J2.A8 | 69.85,82.23 70.8,83.19 J3.A8 | 44.45,82.23 69.85,82.23 | 95.25,82.23 96.2,83.19 J4.A8 | 69.85,82.23 95.25,82.23 | 120.65,82.23 121.6,83.19 J5.A8 | 95.25,82.23 120.65,82.23 | 146.05,82.23 147,83.19 J6.A8 | 120.65,82.23 146.05,82.23 | 171.45,82.23 172.4,83.19 J7.A8 | 146.05,82.23 171.45,82.23 | 196.85,82.23 197.8,83.19 J8.A8 | 171.45,82.23 196.85,82.23 | 222.25,82.23 223.2,83.19 J9.A8 | 196.85,82.23 222.25,82.23
D6
  Top 0.127: RN1.8 261.94,80.64 260.99,79.69 249.87,79.69 248.92,80.64 J10.A9 248.6,80.64 247.65,79.69 222.25,79.69 | 44.45,79.69 21.27,79.69 20.32,80.64 J1.A9 | 44.45,79.69 45.4,80.64 J2.A9 | 69.85,79.69 70.8,80.64 J3.A9 | 44.45,79.69 69.85,79.69 | 95.25,79.69 96.2,80.64 J4.A9 | 69.85,79.69 95.25,79.69 | 120.65,79.69 121.6,80.64 J5.A9 | 95.25,79.69 120.65,79.69 | 146.05,79.69 147,80.64 J6.A9 | 120.65,79.69 146.05,79.69 | 171.45,79.69 172.4,80.64 J7.A9 | 146.05,79.69 171.45,79.69 | 196.85,79.69 197.8,80.64 J8.A9 | 171.45,79.69 196.85,79.69 | 222.25,79.69 223.2,80.64 J9.A9 | 196.85,79.69 222.25,79.69
D7
  Top 0.127: RN1.9 261.94,78.11 260.99,77.15 249.87,77.15 248.92,78.11 J10.A10 248.6,78.11 247.65,77.15 222.25,77.15 | 44.45,77.15 21.27,77.15 20.32,78.11 J1.A10 | 44.45,77.15 45.4,78.11 J2.A10 | 69.85,77.15 70.8,78.11 J3.A10 | 44.45,77.15 69.85,77.15 | 95.25,77.15 96.2,78.11 J4.A10 | 69.85,77.15 95.25,77.15 | 120.65,77.15 121.6,78.11 J5.A10 | 95.25,77.15 120.65,77.15 | 146.05,77.15 147,78.11 J6.A10 | 120.65,77.15 146.05,77.15 | 171.45,77.15 172.4,78.11 J7.A10 | 146.05,77.15 171.45,77.15 | 196.85,77.15 197.8,78.11 J8.A10 | 171.45,77.15 196.85,77.15 | 222.25,77.15 223.2,78.11 J9.A10 | 196.85,77.15 222.25,77.15
DLD0
  Top 0.127: 44.45,61.91 21.27,61.91 20.32,62.87 J1.A16 | 44.45,61.91 45.4,62.87 J2.A16 | 69.85,61.91 70.8,62.87 J3.A16 | 44.45,61.91 69.85,61.91 | 95.25,61.91 96.2,62.87 J4.A16 | 69.85,61.91 95.25,61.91 | 120.65,61.91 121.6,62.87 J5.A16 | 95.25,61.91 120.65,61.91 | 146.05,61.91 147,62.87 J6.A16 | 120.65,61.91 146.05,61.91 | 171.45,61.91 172.4,62.87 J7.A16 | 146.05,61.91 171.45,61.91 | 196.85,61.91 197.8,62.87 J8.A16 | 171.45,61.91 196.85,61.91 | 222.25,61.91 223.2,62.87 J9.A16 | 196.85,61.91 222.25,61.91 | 222.25,61.91 247.65,61.91 248.6,62.87 J10.A16
DLD1
  Top 0.127: 44.45,59.37 21.27,59.37 20.32,60.33 J1.A17 | 44.45,59.37 45.4,60.33 J2.A17 | 69.85,59.37 70.8,60.33 J3.A17 | 44.45,59.37 69.85,59.37 | 95.25,59.37 96.2,60.33 J4.A17 | 69.85,59.37 95.25,59.37 | 120.65,59.37 121.6,60.33 J5.A17 | 95.25,59.37 120.65,59.37 | 146.05,59.37 147,60.33 J6.A17 | 120.65,59.37 146.05,59.37 | 171.45,59.37 172.4,60.33 J7.A17 | 146.05,59.37 171.45,59.37 | 196.85,59.37 197.8,60.33 J8.A17 | 171.45,59.37 196.85,59.37 | 222.25,59.37 223.2,60.33 J9.A17 | 196.85,59.37 222.25,59.37 | 222.25,59.37 247.65,59.37 248.6,60.33 J10.A17
DLD2
  Top 0.127: 44.45,56.83 21.27,56.83 20.32,57.78 J1.A18 | 44.45,56.83 45.4,57.78 J2.A18 | 69.85,56.83 70.8,57.78 J3.A18 | 44.45,56.83 69.85,56.83 | 95.25,56.83 96.2,57.78 J4.A18 | 69.85,56.83 95.25,56.83 | 120.65,56.83 121.6,57.78 J5.A18 | 95.25,56.83 120.65,56.83 | 146.05,56.83 147,57.78 J6.A18 | 120.65,56.83 146.05,56.83 | 171.45,56.83 172.4,57.78 J7.A18 | 146.05,56.83 171.45,56.83 | 196.85,56.83 197.8,57.78 J8.A18 | 171.45,56.83 196.85,56.83 | 222.25,56.83 223.2,57.78 J9.A18 | 196.85,56.83 222.25,56.83 | 222.25,56.83 247.65,56.83 248.6,57.78 J10.A18
DLD3
  Top 0.127: 44.45,54.29 21.27,54.29 20.32,55.24 J1.A19 | 44.45,54.29 45.4,55.24 J2.A19 | 69.85,54.29 70.8,55.24 J3.A19 | 44.45,54.29 69.85,54.29 | 95.25,54.29 96.2,55.24 J4.A19 | 69.85,54.29 95.25,54.29 | 120.65,54.29 121.6,55.24 J5.A19 | 95.25,54.29 120.65,54.29 | 146.05,54.29 147,55.24 J6.A19 | 120.65,54.29 146.05,54.29 | 171.45,54.29 172.4,55.24 J7.A19 | 146.05,54.29 171.45,54.29 | 196.85,54.29 197.8,55.24 J8.A19 | 171.45,54.29 196.85,54.29 | 222.25,54.29 223.2,55.24 J9.A19 | 196.85,54.29 222.25,54.29 | 222.25,54.29 247.65,54.29 248.6,55.24 J10.A19
DOE0
  Top 0.127: 44.45,72.07 21.27,72.07 20.32,73.03 J1.A12 | 44.45,72.07 45.4,73.03 J2.A12 | 69.85,72.07 70.8,73.03 J3.A12 | 44.45,72.07 69.85,72.07 | 95.25,72.07 96.2,73.03 J4.A12 | 69.85,72.07 95.25,72.07 | 120.65,72.07 121.6,73.03 J5.A12 | 95.25,72.07 120.65,72.07 | 146.05,72.07 147,73.03 J6.A12 | 120.65,72.07 146.05,72.07 | 171.45,72.07 172.4,73.03 J7.A12 | 146.05,72.07 171.45,72.07 | 196.85,72.07 197.8,73.03 J8.A12 | 171.45,72.07 196.85,72.07 | 222.25,72.07 223.2,73.03 J9.A12 | 196.85,72.07 222.25,72.07 | 222.25,72.07 247.65,72.07 248.6,73.03 J10.A12
DOE1
  Top 0.127: 44.45,69.53 21.27,69.53 20.32,70.48 J1.A13 | 44.45,69.53 45.4,70.48 J2.A13 | 69.85,69.53 70.8,70.48 J3.A13 | 44.45,69.53 69.85,69.53 | 95.25,69.53 96.2,70.48 J4.A13 | 69.85,69.53 95.25,69.53 | 120.65,69.53 121.6,70.48 J5.A13 | 95.25,69.53 120.65,69.53 | 146.05,69.53 147,70.48 J6.A13 | 120.65,69.53 146.05,69.53 | 171.45,69.53 172.4,70.48 J7.A13 | 146.05,69.53 171.45,69.53 | 196.85,69.53 197.8,70.48 J8.A13 | 171.45,69.53 196.85,69.53 | 222.25,69.53 223.2,70.48 J9.A13 | 196.85,69.53 222.25,69.53 | 222.25,69.53 247.65,69.53 248.6,70.48 J10.A13
DOE2
  Top 0.127: 44.45,66.99 21.27,66.99 20.32,67.94 J1.A14 | 44.45,66.99 45.4,67.94 J2.A14 | 69.85,66.99 70.8,67.94 J3.A14 | 44.45,66.99 69.85,66.99 | 95.25,66.99 96.2,67.94 J4.A14 | 69.85,66.99 95.25,66.99 | 120.65,66.99 121.6,67.94 J5.A14 | 95.25,66.99 120.65,66.99 | 146.05,66.99 147,67.94 J6.A14 | 120.65,66.99 146.05,66.99 | 171.45,66.99 172.4,67.94 J7.A14 | 146.05,66.99 171.45,66.99 | 196.85,66.99 197.8,67.94 J8.A14 | 171.45,66.99 196.85,66.99 | 222.25,66.99 223.2,67.94 J9.A14 | 196.85,66.99 222.25,66.99 | 222.25,66.99 247.65,66.99 248.6,67.94 J10.A14
DOE3
  Top 0.127: 44.45,64.45 21.27,64.45 20.32,65.41 J1.A15 | 44.45,64.45 45.4,65.41 J2.A15 | 69.85,64.45 70.8,65.41 J3.A15 | 44.45,64.45 69.85,64.45 | 95.25,64.45 96.2,65.41 J4.A15 | 69.85,64.45 95.25,64.45 | 120.65,64.45 121.6,65.41 J5.A15 | 95.25,64.45 120.65,64.45 | 146.05,64.45 147,65.41 J6.A15 | 120.65,64.45 146.05,64.45 | 171.45,64.45 172.4,65.41 J7.A15 | 146.05,64.45 171.45,64.45 | 196.85,64.45 197.8,65.41 J8.A15 | 171.45,64.45 196.85,64.45 | 222.25,64.45 223.2,65.41 J9.A15 | 196.85,64.45 222.25,64.45 | 222.25,64.45 247.65,64.45 248.6,65.41 J10.A15
FC
  Top 0.127: 44.45,33.97 21.27,33.97 20.32,34.92 J1.A27 | 44.45,33.97 45.4,34.92 J2.A27 | 69.85,33.97 70.8,34.92 J3.A27 | 44.45,33.97 69.85,33.97 | 95.25,33.97 96.2,34.92 J4.A27 | 69.85,33.97 95.25,33.97 | 120.65,33.97 121.6,34.92 J5.A27 | 95.25,33.97 120.65,33.97 | 146.05,33.97 147,34.92 J6.A27 | 120.65,33.97 146.05,33.97 | 171.45,33.97 172.4,34.92 J7.A27 | 146.05,33.97 171.45,33.97 | 196.85,33.97 197.8,34.92 J8.A27 | 171.45,33.97 196.85,33.97 | 222.25,33.97 223.2,34.92 J9.A27 | 196.85,33.97 222.25,33.97 | 222.25,33.97 247.65,33.97 248.6,34.92 J10.A27
FN
  Top 0.127: 44.45,28.89 21.27,28.89 20.32,29.84 J1.A29 | 44.45,28.89 45.4,29.84 J2.A29 | 69.85,28.89 70.8,29.84 J3.A29 | 44.45,28.89 69.85,28.89 | 95.25,28.89 96.2,29.84 J4.A29 | 69.85,28.89 95.25,28.89 | 120.65,28.89 121.6,29.84 J5.A29 | 95.25,28.89 120.65,28.89 | 146.05,28.89 147,29.84 J6.A29 | 120.65,28.89 146.05,28.89 | 171.45,28.89 172.4,29.84 J7.A29 | 146.05,28.89 171.45,28.89 | 196.85,28.89 197.8,29.84 J8.A29 | 171.45,28.89 196.85,28.89 | 222.25,28.89 223.2,29.84 J9.A29 | 196.85,28.89 222.25,28.89 | 222.25,28.89 247.65,28.89 248.6,29.84 J10.A29
FV
  Top 0.127: 44.45,26.35 21.27,26.35 20.32,27.3 J1.A30 | 44.45,26.35 45.4,27.3 J2.A30 | 69.85,26.35 70.8,27.3 J3.A30 | 44.45,26.35 69.85,26.35 | 95.25,26.35 96.2,27.3 J4.A30 | 69.85,26.35 95.25,26.35 | 120.65,26.35 121.6,27.3 J5.A30 | 95.25,26.35 120.65,26.35 | 146.05,26.35 147,27.3 J6.A30 | 120.65,26.35 146.05,26.35 | 171.45,26.35 172.4,27.3 J7.A30 | 146.05,26.35 171.45,26.35 | 196.85,26.35 197.8,27.3 J8.A30 | 171.45,26.35 196.85,26.35 | 222.25,26.35 223.2,27.3 J9.A30 | 196.85,26.35 222.25,26.35 | 222.25,26.35 247.65,26.35 248.6,27.3 J10.A30
FZ
  Top 0.127: 44.45,31.43 21.27,31.43 20.32,32.38 J1.A28 | 44.45,31.43 45.4,32.38 J2.A28 | 69.85,31.43 70.8,32.38 J3.A28 | 44.45,31.43 69.85,31.43 | 95.25,31.43 96.2,32.38 J4.A28 | 69.85,31.43 95.25,31.43 | 120.65,31.43 121.6,32.38 J5.A28 | 95.25,31.43 120.65,31.43 | 146.05,31.43 147,32.38 J6.A28 | 120.65,31.43 146.05,31.43 | 171.45,31.43 172.4,32.38 J7.A28 | 146.05,31.43 171.45,31.43 | 196.85,31.43 197.8,32.38 J8.A28 | 171.45,31.43 196.85,31.43 | 222.25,31.43 223.2,32.38 J9.A28 | 196.85,31.43 222.25,31.43 | 222.25,31.43 247.65,31.43 248.6,32.38 J10.A28
GND
  pour Route2 (isolate 0.3): 0,0 300,0 300,128 0,128
IRQ
  Bottom 0.127: 46.99,31.11 25.08,31.11 24.13,30.16 22.86,30.16 J1.B29 | 46.99,31.11 47.94,30.16 J2.B29 | 71.12,31.11 72.07,30.16 73.34,30.16 J3.B29 | 46.99,31.11 71.12,31.11 | 96.52,31.11 97.47,30.16 98.74,30.16 J4.B29 | 71.12,31.11 96.52,31.11 | 121.92,31.11 122.87,30.16 124.14,30.16 J5.B29 | 96.52,31.11 121.92,31.11 | 147.32,31.11 148.27,30.16 149.54,30.16 J6.B29 | 121.92,31.11 147.32,31.11 | 172.72,31.11 173.67,30.16 174.94,30.16 J7.B29 | 147.32,31.11 172.72,31.11 | 198.12,31.11 199.07,30.16 200.34,30.16 J8.B29 | 172.72,31.11 198.12,31.11 | 223.52,31.11 224.47,30.16 225.74,30.16 J9.B29 | 198.12,31.11 223.52,31.11 | 248.92,31.11 249.87,30.16 251.14,30.16 J10.B29 | 223.52,31.11 248.92,31.11 | 248.92,31.11 254,31.11 273.69,50.8 273.69,70.8 R4.1
LDF
  Top 0.127: 44.45,36.51 21.27,36.51 20.32,37.47 J1.A26 | 44.45,36.51 45.4,37.47 J2.A26 | 69.85,36.51 70.8,37.47 J3.A26 | 44.45,36.51 69.85,36.51 | 95.25,36.51 96.2,37.47 J4.A26 | 69.85,36.51 95.25,36.51 | 120.65,36.51 121.6,37.47 J5.A26 | 95.25,36.51 120.65,36.51 | 146.05,36.51 147,37.47 J6.A26 | 120.65,36.51 146.05,36.51 | 171.45,36.51 172.4,37.47 J7.A26 | 146.05,36.51 171.45,36.51 | 196.85,36.51 197.8,37.47 J8.A26 | 171.45,36.51 196.85,36.51 | 222.25,36.51 223.2,37.47 J9.A26 | 196.85,36.51 222.25,36.51 | 222.25,36.51 247.65,36.51 248.6,37.47 J10.A26
LDZN
  Top 0.127: 49.53,33.66 26.35,33.66 25.4,32.7 J1.C28 | 49.53,33.66 50.48,32.7 J2.C28 | 74.93,33.66 75.88,32.7 J3.C28 | 49.53,33.66 74.93,33.66 | 100.33,33.66 101.28,32.7 J4.C28 | 74.93,33.66 100.33,33.66 | 125.73,33.66 126.68,32.7 J5.C28 | 100.33,33.66 125.73,33.66 | 151.13,33.66 152.08,32.7 J6.C28 | 125.73,33.66 151.13,33.66 | 176.53,33.66 177.48,32.7 J7.C28 | 151.13,33.66 176.53,33.66 | 201.93,33.66 202.88,32.7 J8.C28 | 176.53,33.66 201.93,33.66 | 227.33,33.66 228.28,32.7 J9.C28 | 201.93,33.66 227.33,33.66 | 227.33,33.66 252.73,33.66 253.68,32.7 J10.C28
LED_A
  Top 0.127: R1.2 15.24,3.17 20.95,3.17 LED1.2
PDEC
  Top 0.127: 44.45,44.13 21.27,44.13 20.32,45.09 J1.A23 | 44.45,44.13 45.4,45.09 J2.A23 | 69.85,44.13 70.8,45.09 J3.A23 | 44.45,44.13 69.85,44.13 | 95.25,44.13 96.2,45.09 J4.A23 | 69.85,44.13 95.25,44.13 | 120.65,44.13 121.6,45.09 J5.A23 | 95.25,44.13 120.65,44.13 | 146.05,44.13 147,45.09 J6.A23 | 120.65,44.13 146.05,44.13 | 171.45,44.13 172.4,45.09 J7.A23 | 146.05,44.13 171.45,44.13 | 196.85,44.13 197.8,45.09 J8.A23 | 171.45,44.13 196.85,44.13 | 222.25,44.13 223.2,45.09 J9.A23 | 196.85,44.13 222.25,44.13 | 222.25,44.13 247.65,44.13 248.6,45.09 J10.A23
PINC
  Top 0.127: 44.45,46.67 21.27,46.67 20.32,47.62 J1.A22 | 44.45,46.67 45.4,47.62 J2.A22 | 69.85,46.67 70.8,47.62 J3.A22 | 44.45,46.67 69.85,46.67 | 95.25,46.67 96.2,47.62 J4.A22 | 69.85,46.67 95.25,46.67 | 120.65,46.67 121.6,47.62 J5.A22 | 95.25,46.67 120.65,46.67 | 146.05,46.67 147,47.62 J6.A22 | 120.65,46.67 146.05,46.67 | 171.45,46.67 172.4,47.62 J7.A22 | 146.05,46.67 171.45,46.67 | 196.85,46.67 197.8,47.62 J8.A22 | 171.45,46.67 196.85,46.67 | 222.25,46.67 223.2,47.62 J9.A22 | 196.85,46.67 222.25,46.67 | 222.25,46.67 247.65,46.67 248.6,47.62 J10.A22
PSEL0
  Top 0.127: 44.45,51.75 21.27,51.75 20.32,52.7 J1.A20 | 44.45,51.75 45.4,52.7 J2.A20 | 69.85,51.75 70.8,52.7 J3.A20 | 44.45,51.75 69.85,51.75 | 95.25,51.75 96.2,52.7 J4.A20 | 69.85,51.75 95.25,51.75 | 120.65,51.75 121.6,52.7 J5.A20 | 95.25,51.75 120.65,51.75 | 146.05,51.75 147,52.7 J6.A20 | 120.65,51.75 146.05,51.75 | 171.45,51.75 172.4,52.7 J7.A20 | 146.05,51.75 171.45,51.75 | 196.85,51.75 197.8,52.7 J8.A20 | 171.45,51.75 196.85,51.75 | 222.25,51.75 223.2,52.7 J9.A20 | 196.85,51.75 222.25,51.75 | 222.25,51.75 247.65,51.75 248.6,52.7 J10.A20
PSEL1
  Top 0.127: 44.45,49.21 21.27,49.21 20.32,50.16 J1.A21 | 44.45,49.21 45.4,50.16 J2.A21 | 69.85,49.21 70.8,50.16 J3.A21 | 44.45,49.21 69.85,49.21 | 95.25,49.21 96.2,50.16 J4.A21 | 69.85,49.21 95.25,49.21 | 120.65,49.21 121.6,50.16 J5.A21 | 95.25,49.21 120.65,49.21 | 146.05,49.21 147,50.16 J6.A21 | 120.65,49.21 146.05,49.21 | 171.45,49.21 172.4,50.16 J7.A21 | 146.05,49.21 171.45,49.21 | 196.85,49.21 197.8,50.16 J8.A21 | 171.45,49.21 196.85,49.21 | 222.25,49.21 223.2,50.16 J9.A21 | 196.85,49.21 222.25,49.21 | 222.25,49.21 247.65,49.21 248.6,50.16 J10.A21
PSEL2
  Top 0.127: 49.53,36.2 26.35,36.2 25.4,35.24 J1.C27 | 49.53,36.2 50.48,35.24 J2.C27 | 74.93,36.2 75.88,35.24 J3.C27 | 49.53,36.2 74.93,36.2 | 100.33,36.2 101.28,35.24 J4.C27 | 74.93,36.2 100.33,36.2 | 125.73,36.2 126.68,35.24 J5.C27 | 100.33,36.2 125.73,36.2 | 151.13,36.2 152.08,35.24 J6.C27 | 125.73,36.2 151.13,36.2 | 176.53,36.2 177.48,35.24 J7.C27 | 151.13,36.2 176.53,36.2 | 201.93,36.2 202.88,35.24 J8.C27 | 176.53,36.2 201.93,36.2 | 227.33,36.2 228.28,35.24 J9.C27 | 201.93,36.2 227.33,36.2 | 227.33,36.2 252.73,36.2 253.68,35.24 J10.C27
SETC
  Top 0.127: 49.53,28.57 26.35,28.57 25.4,27.62 J1.C30 | 49.53,28.57 50.48,27.62 J2.C30 | 74.93,28.57 75.88,27.62 J3.C30 | 49.53,28.57 74.93,28.57 | 100.33,28.57 101.28,27.62 J4.C30 | 74.93,28.57 100.33,28.57 | 125.73,28.57 126.68,27.62 J5.C30 | 100.33,28.57 125.73,28.57 | 151.13,28.57 152.08,27.62 J6.C30 | 125.73,28.57 151.13,28.57 | 176.53,28.57 177.48,27.62 J7.C30 | 151.13,28.57 176.53,28.57 | 201.93,28.57 202.88,27.62 J8.C30 | 176.53,28.57 201.93,28.57 | 227.33,28.57 228.28,27.62 J9.C30 | 201.93,28.57 227.33,28.57 | 227.33,28.57 252.73,28.57 253.68,27.62 J10.C30
SH0
  Top 0.127: 49.53,41.27 26.35,41.27 25.4,40.32 J1.C25 | 49.53,41.27 50.48,40.32 J2.C25 | 74.93,41.27 75.88,40.32 J3.C25 | 49.53,41.27 74.93,41.27 | 100.33,41.27 101.28,40.32 J4.C25 | 74.93,41.27 100.33,41.27 | 125.73,41.27 126.68,40.32 J5.C25 | 100.33,41.27 125.73,41.27 | 151.13,41.27 152.08,40.32 J6.C25 | 125.73,41.27 151.13,41.27 | 176.53,41.27 177.48,40.32 J7.C25 | 151.13,41.27 176.53,41.27 | 201.93,41.27 202.88,40.32 J8.C25 | 176.53,41.27 201.93,41.27 | 227.33,41.27 228.28,40.32 J9.C25 | 201.93,41.27 227.33,41.27 | 227.33,41.27 252.73,41.27 253.68,40.32 J10.C25
SH1
  Top 0.127: 49.53,38.73 26.35,38.73 25.4,37.78 J1.C26 | 49.53,38.73 50.48,37.78 J2.C26 | 74.93,38.73 75.88,37.78 J3.C26 | 49.53,38.73 74.93,38.73 | 100.33,38.73 101.28,37.78 J4.C26 | 74.93,38.73 100.33,38.73 | 125.73,38.73 126.68,37.78 J5.C26 | 100.33,38.73 125.73,38.73 | 151.13,38.73 152.08,37.78 J6.C26 | 125.73,38.73 151.13,38.73 | 176.53,38.73 177.48,37.78 J7.C26 | 151.13,38.73 176.53,38.73 | 201.93,38.73 202.88,37.78 J8.C26 | 176.53,38.73 201.93,38.73 | 227.33,38.73 228.28,37.78 J9.C26 | 201.93,38.73 227.33,38.73 | 227.33,38.73 252.73,38.73 253.68,37.78 J10.C26
SHCIN
  Top 0.127: 49.53,31.11 26.35,31.11 25.4,30.16 J1.C29 | 49.53,31.11 50.48,30.16 J2.C29 | 74.93,31.11 75.88,30.16 J3.C29 | 49.53,31.11 74.93,31.11 | 100.33,31.11 101.28,30.16 J4.C29 | 74.93,31.11 100.33,31.11 | 125.73,31.11 126.68,30.16 J5.C29 | 100.33,31.11 125.73,31.11 | 151.13,31.11 152.08,30.16 J6.C29 | 125.73,31.11 151.13,31.11 | 176.53,31.11 177.48,30.16 J7.C29 | 151.13,31.11 176.53,31.11 | 201.93,31.11 202.88,30.16 J8.C29 | 176.53,31.11 201.93,31.11 | 227.33,31.11 228.28,30.16 J9.C29 | 201.93,31.11 227.33,31.11 | 227.33,31.11 252.73,31.11 253.68,30.16 J10.C29
SPARE11
  Bottom 0.127: 46.99,28.57 25.08,28.57 24.13,27.62 22.86,27.62 J1.B30 | 46.99,28.57 47.94,27.62 J2.B30 | 71.12,28.57 72.07,27.62 73.34,27.62 J3.B30 | 46.99,28.57 71.12,28.57 | 96.52,28.57 97.47,27.62 98.74,27.62 J4.B30 | 71.12,28.57 96.52,28.57 | 121.92,28.57 122.87,27.62 124.14,27.62 J5.B30 | 96.52,28.57 121.92,28.57 | 147.32,28.57 148.27,27.62 149.54,27.62 J6.B30 | 121.92,28.57 147.32,28.57 | 172.72,28.57 173.67,27.62 174.94,27.62 J7.B30 | 147.32,28.57 172.72,28.57 | 198.12,28.57 199.07,27.62 200.34,27.62 J8.B30 | 172.72,28.57 198.12,28.57 | 223.52,28.57 224.47,27.62 225.74,27.62 J9.B30 | 198.12,28.57 223.52,28.57 | 223.52,28.57 248.92,28.57 249.87,27.62 251.14,27.62 J10.B30
SPARE12
  Bottom 0.127: 46.99,94.61 25.08,94.61 24.13,93.66 22.86,93.66 J1.B4 | 46.99,94.61 47.94,93.66 J2.B4 | 71.12,94.61 72.07,93.66 73.34,93.66 J3.B4 | 46.99,94.61 71.12,94.61 | 96.52,94.61 97.47,93.66 98.74,93.66 J4.B4 | 71.12,94.61 96.52,94.61 | 121.92,94.61 122.87,93.66 124.14,93.66 J5.B4 | 96.52,94.61 121.92,94.61 | 147.32,94.61 148.27,93.66 149.54,93.66 J6.B4 | 121.92,94.61 147.32,94.61 | 172.72,94.61 173.67,93.66 174.94,93.66 J7.B4 | 147.32,94.61 172.72,94.61 | 198.12,94.61 199.07,93.66 200.34,93.66 J8.B4 | 172.72,94.61 198.12,94.61 | 223.52,94.61 224.47,93.66 225.74,93.66 J9.B4 | 198.12,94.61 223.52,94.61 | 223.52,94.61 248.92,94.61 249.87,93.66 251.14,93.66 J10.B4
SPARE13
  Bottom 0.127: 46.99,89.53 25.08,89.53 24.13,88.58 22.86,88.58 J1.B6 | 46.99,89.53 47.94,88.58 J2.B6 | 71.12,89.53 72.07,88.58 73.34,88.58 J3.B6 | 46.99,89.53 71.12,89.53 | 96.52,89.53 97.47,88.58 98.74,88.58 J4.B6 | 71.12,89.53 96.52,89.53 | 121.92,89.53 122.87,88.58 124.14,88.58 J5.B6 | 96.52,89.53 121.92,89.53 | 147.32,89.53 148.27,88.58 149.54,88.58 J6.B6 | 121.92,89.53 147.32,89.53 | 172.72,89.53 173.67,88.58 174.94,88.58 J7.B6 | 147.32,89.53 172.72,89.53 | 198.12,89.53 199.07,88.58 200.34,88.58 J8.B6 | 172.72,89.53 198.12,89.53 | 223.52,89.53 224.47,88.58 225.74,88.58 J9.B6 | 198.12,89.53 223.52,89.53 | 223.52,89.53 248.92,89.53 249.87,88.58 251.14,88.58 J10.B6
SPARE14
  Bottom 0.127: 46.99,84.45 25.08,84.45 24.13,83.5 22.86,83.5 J1.B8 | 46.99,84.45 47.94,83.5 J2.B8 | 71.12,84.45 72.07,83.5 73.34,83.5 J3.B8 | 46.99,84.45 71.12,84.45 | 96.52,84.45 97.47,83.5 98.74,83.5 J4.B8 | 71.12,84.45 96.52,84.45 | 121.92,84.45 122.87,83.5 124.14,83.5 J5.B8 | 96.52,84.45 121.92,84.45 | 147.32,84.45 148.27,83.5 149.54,83.5 J6.B8 | 121.92,84.45 147.32,84.45 | 172.72,84.45 173.67,83.5 174.94,83.5 J7.B8 | 147.32,84.45 172.72,84.45 | 198.12,84.45 199.07,83.5 200.34,83.5 J8.B8 | 172.72,84.45 198.12,84.45 | 223.52,84.45 224.47,83.5 225.74,83.5 J9.B8 | 198.12,84.45 223.52,84.45 | 223.52,84.45 248.92,84.45 249.87,83.5 251.14,83.5 J10.B8
SPARE15
  Bottom 0.127: 46.99,79.38 25.08,79.38 24.13,78.42 22.86,78.42 J1.B10 | 46.99,79.38 47.94,78.42 J2.B10 | 71.12,79.38 72.07,78.42 73.34,78.42 J3.B10 | 46.99,79.38 71.12,79.38 | 96.52,79.38 97.47,78.42 98.74,78.42 J4.B10 | 71.12,79.38 96.52,79.38 | 121.92,79.38 122.87,78.42 124.14,78.42 J5.B10 | 96.52,79.38 121.92,79.38 | 147.32,79.38 148.27,78.42 149.54,78.42 J6.B10 | 121.92,79.38 147.32,79.38 | 172.72,79.38 173.67,78.42 174.94,78.42 J7.B10 | 147.32,79.38 172.72,79.38 | 198.12,79.38 199.07,78.42 200.34,78.42 J8.B10 | 172.72,79.38 198.12,79.38 | 223.52,79.38 224.47,78.42 225.74,78.42 J9.B10 | 198.12,79.38 223.52,79.38 | 223.52,79.38 248.92,79.38 249.87,78.42 251.14,78.42 J10.B10
SPARE16
  Bottom 0.127: 46.99,74.3 25.08,74.3 24.13,73.34 22.86,73.34 J1.B12 | 46.99,74.3 47.94,73.34 J2.B12 | 71.12,74.3 72.07,73.34 73.34,73.34 J3.B12 | 46.99,74.3 71.12,74.3 | 96.52,74.3 97.47,73.34 98.74,73.34 J4.B12 | 71.12,74.3 96.52,74.3 | 121.92,74.3 122.87,73.34 124.14,73.34 J5.B12 | 96.52,74.3 121.92,74.3 | 147.32,74.3 148.27,73.34 149.54,73.34 J6.B12 | 121.92,74.3 147.32,74.3 | 172.72,74.3 173.67,73.34 174.94,73.34 J7.B12 | 147.32,74.3 172.72,74.3 | 198.12,74.3 199.07,73.34 200.34,73.34 J8.B12 | 172.72,74.3 198.12,74.3 | 223.52,74.3 224.47,73.34 225.74,73.34 J9.B12 | 198.12,74.3 223.52,74.3 | 223.52,74.3 248.92,74.3 249.87,73.34 251.14,73.34 J10.B12
SPARE17
  Bottom 0.127: 46.99,69.22 25.08,69.22 24.13,68.26 22.86,68.26 J1.B14 | 46.99,69.22 47.94,68.26 J2.B14 | 71.12,69.22 72.07,68.26 73.34,68.26 J3.B14 | 46.99,69.22 71.12,69.22 | 96.52,69.22 97.47,68.26 98.74,68.26 J4.B14 | 71.12,69.22 96.52,69.22 | 121.92,69.22 122.87,68.26 124.14,68.26 J5.B14 | 96.52,69.22 121.92,69.22 | 147.32,69.22 148.27,68.26 149.54,68.26 J6.B14 | 121.92,69.22 147.32,69.22 | 172.72,69.22 173.67,68.26 174.94,68.26 J7.B14 | 147.32,69.22 172.72,69.22 | 198.12,69.22 199.07,68.26 200.34,68.26 J8.B14 | 172.72,69.22 198.12,69.22 | 223.52,69.22 224.47,68.26 225.74,68.26 J9.B14 | 198.12,69.22 223.52,69.22 | 223.52,69.22 248.92,69.22 249.87,68.26 251.14,68.26 J10.B14
SPARE18
  Bottom 0.127: 46.99,64.14 25.08,64.14 24.13,63.18 22.86,63.18 J1.B16 | 46.99,64.14 47.94,63.18 J2.B16 | 71.12,64.14 72.07,63.18 73.34,63.18 J3.B16 | 46.99,64.14 71.12,64.14 | 96.52,64.14 97.47,63.18 98.74,63.18 J4.B16 | 71.12,64.14 96.52,64.14 | 121.92,64.14 122.87,63.18 124.14,63.18 J5.B16 | 96.52,64.14 121.92,64.14 | 147.32,64.14 148.27,63.18 149.54,63.18 J6.B16 | 121.92,64.14 147.32,64.14 | 172.72,64.14 173.67,63.18 174.94,63.18 J7.B16 | 147.32,64.14 172.72,64.14 | 198.12,64.14 199.07,63.18 200.34,63.18 J8.B16 | 172.72,64.14 198.12,64.14 | 223.52,64.14 224.47,63.18 225.74,63.18 J9.B16 | 198.12,64.14 223.52,64.14 | 223.52,64.14 248.92,64.14 249.87,63.18 251.14,63.18 J10.B16
SPARE19
  Bottom 0.127: 46.99,59.05 25.08,59.05 24.13,58.1 22.86,58.1 J1.B18 | 46.99,59.05 47.94,58.1 J2.B18 | 71.12,59.05 72.07,58.1 73.34,58.1 J3.B18 | 46.99,59.05 71.12,59.05 | 96.52,59.05 97.47,58.1 98.74,58.1 J4.B18 | 71.12,59.05 96.52,59.05 | 121.92,59.05 122.87,58.1 124.14,58.1 J5.B18 | 96.52,59.05 121.92,59.05 | 147.32,59.05 148.27,58.1 149.54,58.1 J6.B18 | 121.92,59.05 147.32,59.05 | 172.72,59.05 173.67,58.1 174.94,58.1 J7.B18 | 147.32,59.05 172.72,59.05 | 198.12,59.05 199.07,58.1 200.34,58.1 J8.B18 | 172.72,59.05 198.12,59.05 | 223.52,59.05 224.47,58.1 225.74,58.1 J9.B18 | 198.12,59.05 223.52,59.05 | 223.52,59.05 248.92,59.05 249.87,58.1 251.14,58.1 J10.B18
SPARE20
  Bottom 0.127: 46.99,53.98 25.08,53.98 24.13,53.02 22.86,53.02 J1.B20 | 46.99,53.98 47.94,53.02 J2.B20 | 71.12,53.98 72.07,53.02 73.34,53.02 J3.B20 | 46.99,53.98 71.12,53.98 | 96.52,53.98 97.47,53.02 98.74,53.02 J4.B20 | 71.12,53.98 96.52,53.98 | 121.92,53.98 122.87,53.02 124.14,53.02 J5.B20 | 96.52,53.98 121.92,53.98 | 147.32,53.98 148.27,53.02 149.54,53.02 J6.B20 | 121.92,53.98 147.32,53.98 | 172.72,53.98 173.67,53.02 174.94,53.02 J7.B20 | 147.32,53.98 172.72,53.98 | 198.12,53.98 199.07,53.02 200.34,53.02 J8.B20 | 172.72,53.98 198.12,53.98 | 223.52,53.98 224.47,53.02 225.74,53.02 J9.B20 | 198.12,53.98 223.52,53.98 | 223.52,53.98 248.92,53.98 249.87,53.02 251.14,53.02 J10.B20
SPARE21
  Bottom 0.127: 46.99,48.9 25.08,48.9 24.13,47.94 22.86,47.94 J1.B22 | 46.99,48.9 47.94,47.94 J2.B22 | 71.12,48.9 72.07,47.94 73.34,47.94 J3.B22 | 46.99,48.9 71.12,48.9 | 96.52,48.9 97.47,47.94 98.74,47.94 J4.B22 | 71.12,48.9 96.52,48.9 | 121.92,48.9 122.87,47.94 124.14,47.94 J5.B22 | 96.52,48.9 121.92,48.9 | 147.32,48.9 148.27,47.94 149.54,47.94 J6.B22 | 121.92,48.9 147.32,48.9 | 172.72,48.9 173.67,47.94 174.94,47.94 J7.B22 | 147.32,48.9 172.72,48.9 | 198.12,48.9 199.07,47.94 200.34,47.94 J8.B22 | 172.72,48.9 198.12,48.9 | 223.52,48.9 224.47,47.94 225.74,47.94 J9.B22 | 198.12,48.9 223.52,48.9 | 223.52,48.9 248.92,48.9 249.87,47.94 251.14,47.94 J10.B22
SPARE22
  Bottom 0.127: 46.99,43.81 25.08,43.81 24.13,42.86 22.86,42.86 J1.B24 | 46.99,43.81 47.94,42.86 J2.B24 | 71.12,43.81 72.07,42.86 73.34,42.86 J3.B24 | 46.99,43.81 71.12,43.81 | 96.52,43.81 97.47,42.86 98.74,42.86 J4.B24 | 71.12,43.81 96.52,43.81 | 121.92,43.81 122.87,42.86 124.14,42.86 J5.B24 | 96.52,43.81 121.92,43.81 | 147.32,43.81 148.27,42.86 149.54,42.86 J6.B24 | 121.92,43.81 147.32,43.81 | 172.72,43.81 173.67,42.86 174.94,42.86 J7.B24 | 147.32,43.81 172.72,43.81 | 198.12,43.81 199.07,42.86 200.34,42.86 J8.B24 | 172.72,43.81 198.12,43.81 | 198.12,43.81 223.52,43.81 224.47,42.86 225.74,42.86 J9.B24 226.06,42.55 227.01,41.59 249.24,41.59 250.19,42.55 251.14,42.55 J10.B24
SPARE23
  Bottom 0.127: 46.99,38.73 25.08,38.73 24.13,37.78 22.86,37.78 J1.B26 | 46.99,38.73 47.94,37.78 J2.B26 | 71.12,38.73 72.07,37.78 73.34,37.78 J3.B26 | 46.99,38.73 71.12,38.73 | 96.52,38.73 97.47,37.78 98.74,37.78 J4.B26 | 71.12,38.73 96.52,38.73 | 121.92,38.73 122.87,37.78 124.14,37.78 J5.B26 | 96.52,38.73 121.92,38.73 | 147.32,38.73 148.27,37.78 149.54,37.78 J6.B26 | 121.92,38.73 147.32,38.73 | 172.72,38.73 173.67,37.78 174.94,37.78 J7.B26 | 147.32,38.73 172.72,38.73 | 198.12,38.73 199.07,37.78 200.34,37.78 J8.B26 | 172.72,38.73 198.12,38.73 | 223.52,38.73 224.47,37.78 225.74,37.78 J9.B26 | 198.12,38.73 223.52,38.73 | 223.52,38.73 248.92,38.73 249.87,37.78 251.14,37.78 J10.B26
VCC
  pour Route15 (isolate 0.3): 0,0 300,0 300,128 0,128

## Text on the board
tPlace: P8X 10-SLOT BACKPLANE REV C COMPACT